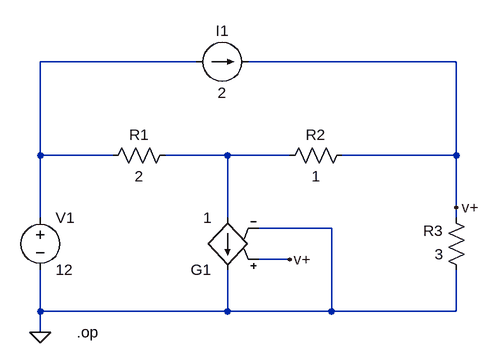
[diagram p0: schematic CH03-KP1-06.asc]
CH03-KP1-06.asc, the LTspice schematic file:
Version 4
SHEET 1 880 680
WIRE 224 144 -16 144
WIRE 624 144 304 144
WIRE -16 288 -16 144
WIRE 96 288 -16 288
WIRE 272 288 176 288
WIRE 368 288 272 288
WIRE 624 288 624 144
WIRE 624 288 448 288
WIRE 624 368 624 288
WIRE -16 384 -16 288
WIRE 272 384 272 288
WIRE 624 384 624 368
WIRE 432 400 320 400
WIRE 368 448 320 448
WIRE -16 528 -16 464
WIRE 272 528 272 464
WIRE 272 528 -16 528
WIRE 432 528 432 400
WIRE 432 528 272 528
WIRE 624 528 624 464
WIRE 624 528 432 528
WIRE -16 560 -16 528
FLAG -16 560 0
FLAG 624 368 v+
FLAG 368 448 v+
DATAFLAG 624 288 "$"
SYMBOL res 192 272 R90
WINDOW 0 0 56 VBottom 2
WINDOW 3 32 56 VTop 2
SYMATTR InstName R1
SYMATTR Value 2
SYMBOL res 464 272 R90
WINDOW 0 0 56 VBottom 2
WINDOW 3 32 56 VTop 2
SYMATTR InstName R2
SYMATTR Value 1
SYMBOL res 640 480 R180
WINDOW 0 36 76 Left 2
WINDOW 3 36 40 Left 2
SYMATTR InstName R3
SYMATTR Value 3
SYMBOL voltage -16 368 R0
SYMATTR InstName V1
SYMATTR Value 12
SYMBOL current 224 144 R270
WINDOW 0 32 40 VTop 2
WINDOW 3 -32 40 VBottom 2
SYMATTR InstName I1
SYMATTR Value 2
SYMBOL g 272 480 R180
SYMATTR InstName G1
SYMATTR Value 1
TEXT 40 560 Left 2 !.op

The netlist it stands for:
* CH03-KP1-06.asc
R1 N002 N001 2
R2 v+ N002 1
R3 0 v+ 3
V1 N001 0 12
I1 N001 v+ 2
G1 N002 0 v+ 0 1
.op
.backanno
.end